# Altium schematic sheet LoadMix.SchDoc
size A; SheetNumber: 1; SheetTotal: 1
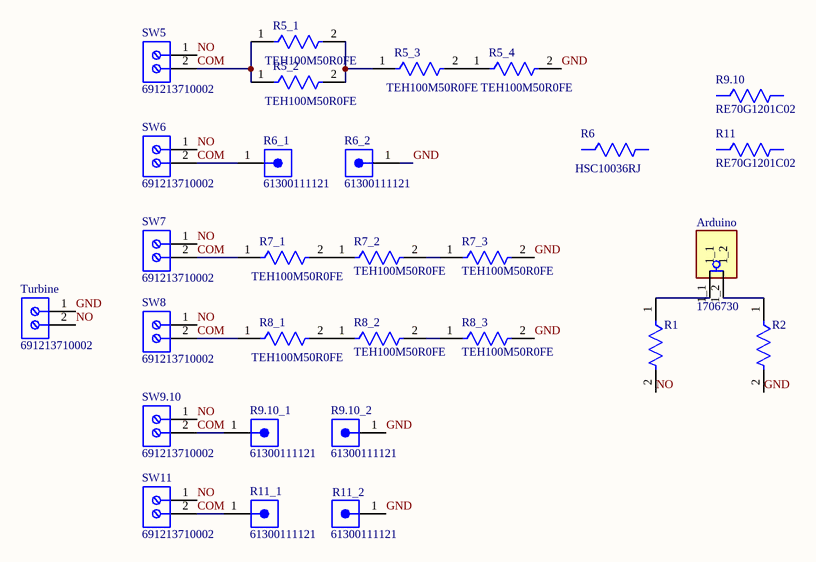
[diagram p0: LoadMix.SchDoc]

## Parts
Arduino  1706730  [PHOENIX_1706730]
R1  (no value)  [FP-MRS25-MFG]
R2  (no value)  [FP-MRS25-MFG]
R5_1  TEH100M50R0FE  [FP-TEH100-MFG]
R5_2  TEH100M50R0FE  [FP-TEH100-MFG]
R5_3  TEH100M50R0FE  [FP-TEH100-MFG]
R5_4  TEH100M50R0FE  [FP-TEH100-MFG]
R6  HSC10036RJ  [FP-HSC10036RJ-MFG]
R6_1  61300111121  [61300111121]
R6_2  61300111121  [61300111121]
R7_1  TEH100M50R0FE  [FP-TEH100-MFG]
R7_2  TEH100M50R0FE  [FP-TEH100-MFG]
R7_3  TEH100M50R0FE  [FP-TEH100-MFG]
R8_1  TEH100M50R0FE  [FP-TEH100-MFG]
R8_2  TEH100M50R0FE  [FP-TEH100-MFG]
R8_3  TEH100M50R0FE  [FP-TEH100-MFG]
R9.10  RE70G1201C02  [FP-RE70G-MFG]
R9.10_1  61300111121  [61300111121]
R9.10_2  61300111121  [61300111121]
R11  RE70G1201C02  [FP-RE70G-MFG]
R11_1  61300111121  [61300111121]
R11_2  61300111121  [61300111121]
SW5  691213710002  [691213710002]
SW6  691213710002  [691213710002]
SW7  691213710002  [691213710002]
SW8  691213710002  [691213710002]
SW9.10  691213710002  [691213710002]
SW11  691213710002  [691213710002]
Turbine  691213710002  [691213710002]

## Nets
COM: R5_1.1 R5_2.1 R6_1.1 R7_1.1 R8_1.1 R9.10_1.1 R11_1.1 SW5.2 SW6.2 SW7.2 SW8.2 SW9.10.2 SW11.2
GND: R2.2 R5_4.2 R6_2.1 R7_3.2 R8_3.2 R9.10_2.1 R11_2.1 Turbine.1
NO: R1.2 SW5.1 SW6.1 SW7.1 SW8.1 SW9.10.1 SW11.1 Turbine.2
NetArduino_1_1: Arduino.1_1 R1.1
NetArduino_1_2: Arduino.1_2 R2.1
NetR5_1_2: R5_1.2 R5_2.2 R5_3.1
NetR5_3_2: R5_3.2 R5_4.1
NetR7_1_2: R7_1.2 R7_2.1
NetR7_2_2: R7_2.2 R7_3.1
NetR8_1_2: R8_1.2 R8_2.1
NetR8_2_2: R8_2.2 R8_3.1

## Library data of the parts
Arduino = CMP-007-000000-1: MF: {'manufacturer': u'Phoenix Contact'}; Value: *; Price: None; Design Item ID: 1706730; MP: 1706730; Source: 1706730.SchLib; Package: None; Pin Count: 2; Availability: Unavailable; Component Type: Standard
R1 R2 = CMP-00030-42757237-1: MRS25000C1000FRP00 Resistor, 100 Ohm, ± 1%, 600 mW, Axial Leaded, Metal Film (Thin Film), Professional; Max Power Dissipation: 600mW; Resistance: 100Ω; Voltage Rating: 350V; Temperature Coefficient: 50ppm/°C; Lead Diameter: 600µm; RoHS: Compliant; Radiation Hardening: No; Schedule B: 8533210090, 8533210090; Length: 6.5mm; Packaging: Tape & Reel (TR); Number of Terminations: 2; Mount: Through Hole; Width: 2.5mm; Tolerance: 1%; Military Standard: Not; Voltage Rating (DC): 350V; Contact Plating: Tin; Number of Pins: 2; Max Operating Temperature: 155°C; NexarPartId: 42757237; Diameter: 2.5mm; Composition: Metal Film, Thin Film; REACH SVHC: Unknown; Power Rating: 600mW; Lead Free: Lead Free; Termination: Axial; Case/Package: Axial; Min Operating Temperature: -55°C
R5_1-R5_4 R7_1-R7_3 R8_1-R8_3 = CMP-00273-12698265-1: TEH100M50R0FE Resistor, Thick Film, Res 50 Ohms, Pwr-Rtg100 W, Tol 1%, Radial, TO-247; Lead Diameter: 1.67mm; Max Power Dissipation: 100W; Resistance: 50Ω; Temperature Coefficient: 50ppm/°C; Voltage Rating: 350V; Min Operating Temperature: 25°C; Width: 4.953mm; Lead Pitch: 10.42mm; Terminal Pitch: 10.42mm; Termination: Radial; Length: 15.748mm; Height: 20.955mm; RoHS: Compliant; Number of Terminations: 2; Case/Package: TO-247; Depth: 5.21mm; Mount: Through Hole; Number of Pins: 2; Tolerance: 1%; Power Rating: 100W; Max Operating Temperature: 175°C; Composition: Thick Film; Features: Moisture Resistant; NexarPartId: 12698265; Voltage Rating (DC): 350V; Packaging: Bulk; REACH SVHC: Unknown
R6 = CMP-03213-000002-1: RES CHAS MNT 36 OHM 5% 100W; Voltage Rating: 1.9kV; Number of Resistors: 1; Temperature Coefficient: 50ppm/°C; Lead/Base Style: Fixed; Resistance: 36R; Height: 26mm; Termination: Solder; Packaging: Tray; Resistor Type: Wirewound; ELV: Compliant; Power Rating: 100W; Width: 47.5mm; Tolerance: 5%; Number of Terminations: 2; Voltage Rating (DC): 1.9kV; Package Quantity: 10; Length: 65.5mm; Mount: Chassis Mount; Series: HSC; RoHS Compliant: Yes
R6_1 R6_2 R9.10_1 R9.10_2 R11_1 R11_2 = CMP-1502-01058-3: NexarPartId: 32855518; Current Rating: 3A; Connector Type: Male Pin; Number of Positions: 1; Contact Resistance: 20mΩ; Gender: Male; Operating Supply Voltage: 250V; Orientation: Vertical; Contact Mating Length: 5.9944mm; Termination: Solder; Number of Rows: 1; Number of Pins: 1; Mount: Through Hole; RoHS: Compliant; Contact Material: Copper; Color: Black; Lead Pitch: 2.54mm; Number of Contacts: 1; Contact Plating: Gold; Packaging: Bulk; REACH SVHC: Unknown
R9.10 R11 = CMP-00030-43962945-1: RE70G1201C02 Res Wirewound 1.2K Ohm 1% 20W ±20ppm/C Aluminum Housed AXL Flange Mount Card; Resistance: 1.2kΩ; Temperature Coefficient: 20ppm/°C; Min Operating Temperature: -55°C; Composition: Wirewound; Height: 13.87mm; Width: 27.43mm; RoHS: Compliant; Length: 49.23mm; Radiation Hardening: No; Max Operating Temperature: 250°C; Military Standard: MIL-PRF-18546; NexarPartId: 43962945; Schedule B: 8533210080; Power Rating: 20W; Packaging: Bulk; Tolerance: 1%
SW5-SW8 SW9.10 SW11 Turbine = CMP-1502-02526-2: NexarPartId: 8917718; Number of Contacts: 2; Current Rating: 10A; Stripping Length: -7mm; Wire Gauge (Max): 26AWG; Plating: Brass, Steel; Wire Gauge (Min): 16AWG; Voltage: 300V; Number of Levels: 1; Pitch: 5.0038mm; Color: Green; Number of Pins: 2; Housing Material: Nylon; Termination: Screw; Max Operating Temperature: 105°C; Min Operating Temperature: -40°C; Packaging: Box; Current: 10A; REACH SVHC: Unknown; Width: 10.6mm; RoHS: Compliant; Mount: Through Hole; Height: 10mm; Contact Material: Brass; Length: 8.3mm; Lead Pitch: 5mm; Wire/Cable Gauge: 26AWG; Voltage Rating: 300V; Number of Positions Per Level: 2; Contact Plating: Tin